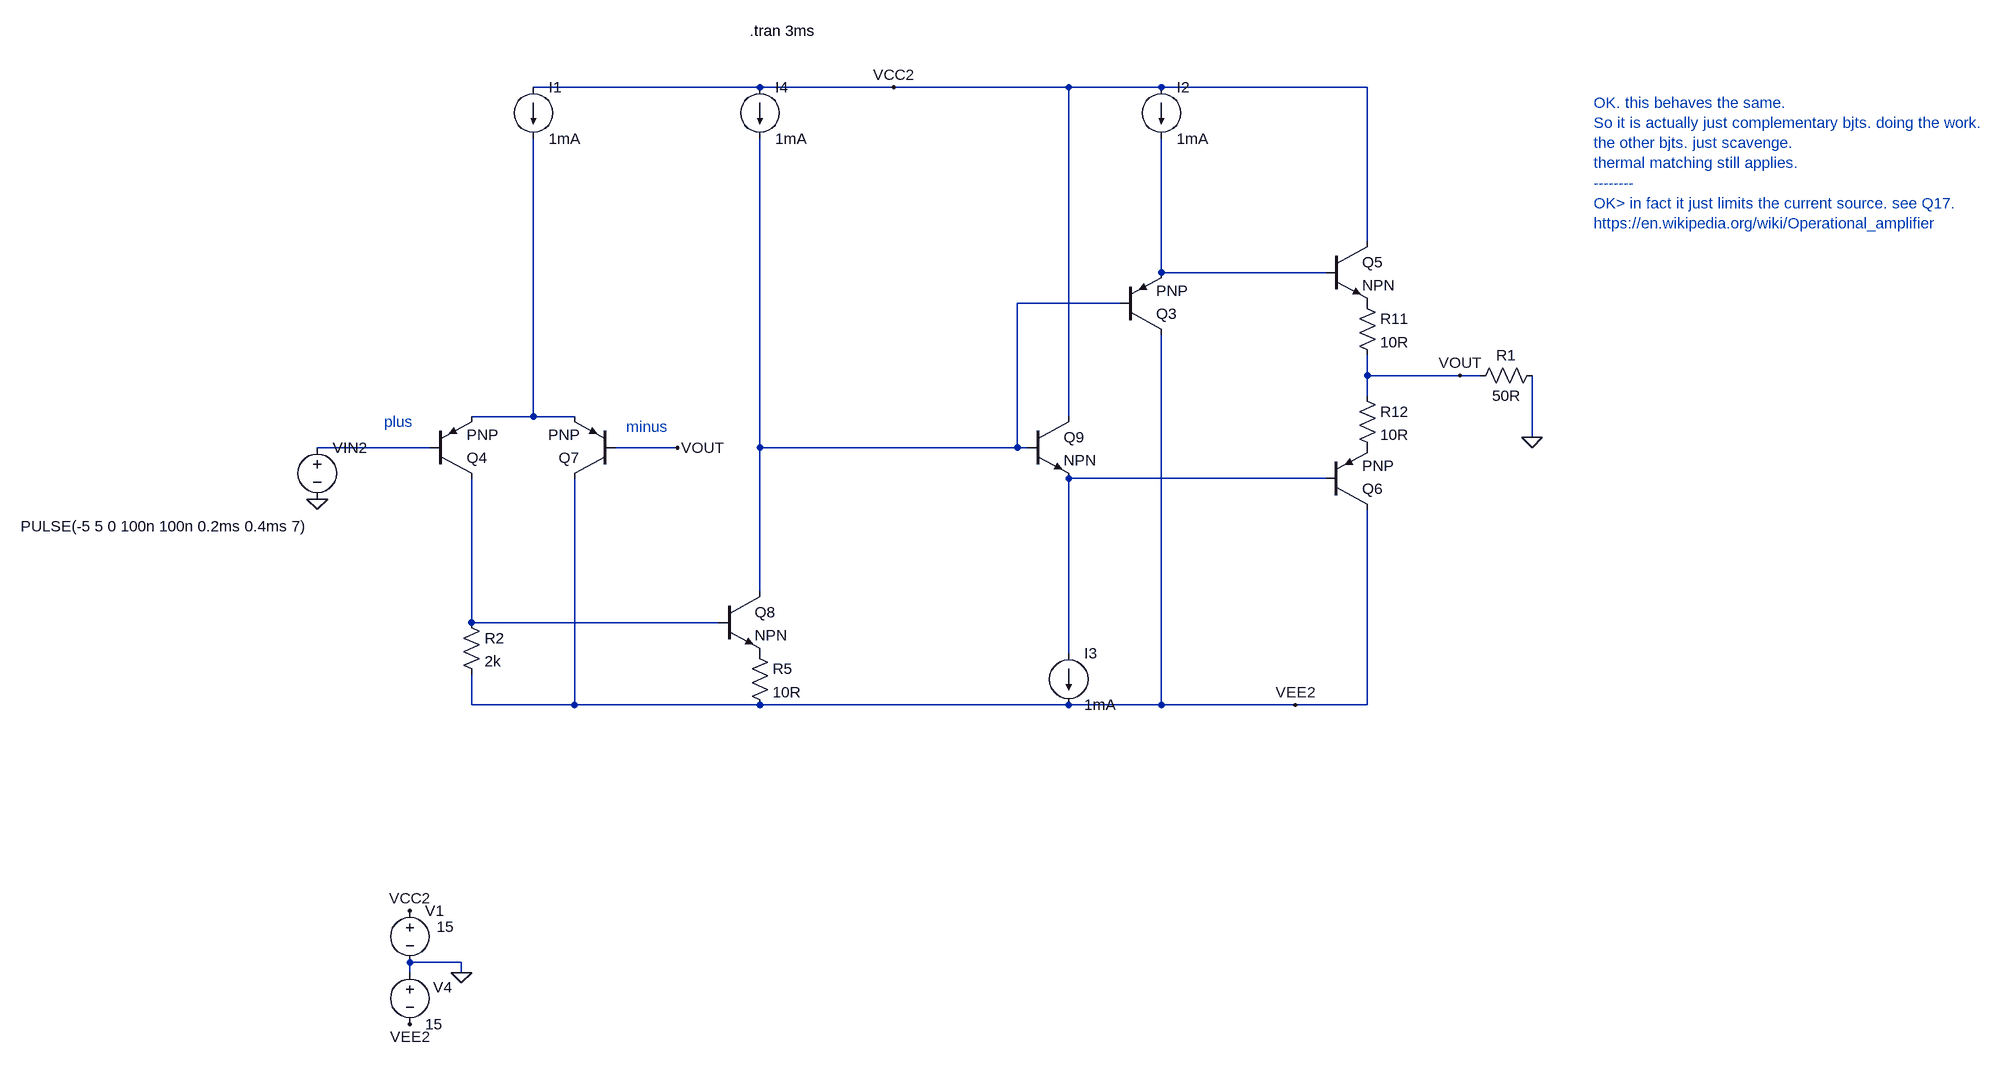
[diagram p0: schematic Draft47.asc]
Draft47.asc, the LTspice schematic file:
Version 4
SHEET 1 2320 1368
WIRE 176 -192 -176 -192
WIRE 384 -192 176 -192
WIRE 656 -192 384 -192
WIRE 800 -192 656 -192
WIRE 1120 -192 800 -192
WIRE 1120 48 1120 -192
WIRE 800 96 800 -112
WIRE 1056 96 800 96
WIRE 736 144 576 144
WIRE 1120 256 1120 224
WIRE 1264 256 1120 256
WIRE 1296 256 1264 256
WIRE 1120 288 1120 256
WIRE -176 320 -176 -112
WIRE -176 320 -272 320
WIRE -112 320 -176 320
WIRE 656 320 656 -192
WIRE 1376 352 1376 256
WIRE -336 368 -512 368
WIRE 48 368 -48 368
WIRE 176 368 176 -112
WIRE 576 368 576 144
WIRE 576 368 176 368
WIRE 592 368 576 368
WIRE 1056 416 656 416
WIRE 176 592 176 368
WIRE -272 640 -272 416
WIRE 112 640 -272 640
WIRE 656 688 656 416
WIRE -272 768 -272 720
WIRE -112 768 -112 416
WIRE -112 768 -272 768
WIRE 176 768 -112 768
WIRE 656 768 176 768
WIRE 800 768 800 192
WIRE 800 768 656 768
WIRE 1008 768 800 768
WIRE 1120 768 1120 464
WIRE 1120 768 1008 768
WIRE -288 1168 -368 1168
WIRE -368 1184 -368 1168
WIRE -288 1184 -288 1168
FLAG -288 1184 0
FLAG -368 1088 VCC2
FLAG -368 1264 VEE2
FLAG 384 -192 VCC2
FLAG 1008 768 VEE2
FLAG 1264 256 VOUT
FLAG 1376 352 0
FLAG -512 448 0
FLAG 48 368 VOUT
SYMBOL voltage -368 1072 R0
WINDOW 123 0 0 Left 0
WINDOW 39 0 0 Left 0
WINDOW 3 42 41 Left 2
SYMATTR Value 15
SYMATTR InstName V1
SYMBOL voltage -368 1168 R0
WINDOW 123 0 0 Left 0
WINDOW 39 0 0 Left 0
WINDOW 0 36 39 Left 2
SYMATTR InstName V4
SYMATTR Value 15
SYMBOL npn 1056 48 R0
SYMATTR InstName Q5
SYMBOL res 1104 128 R0
SYMATTR InstName R11
SYMATTR Value 10R
SYMBOL res 1104 272 R0
SYMATTR InstName R12
SYMATTR Value 10R
SYMBOL pnp 1056 464 M180
SYMATTR InstName Q6
SYMBOL current 800 -192 R0
WINDOW 123 0 0 Left 0
WINDOW 39 0 0 Left 0
SYMATTR InstName I2
SYMATTR Value 1mA
SYMBOL pnp 736 192 M180
SYMATTR InstName Q3
SYMBOL npn 592 320 R0
SYMATTR InstName Q9
SYMBOL current 656 688 R0
WINDOW 123 0 0 Left 0
WINDOW 39 0 0 Left 0
SYMATTR InstName I3
SYMATTR Value 1mA
SYMBOL res 1392 240 R90
WINDOW 0 0 56 VBottom 2
WINDOW 3 32 56 VTop 2
SYMATTR InstName R1
SYMATTR Value 50R
SYMBOL voltage -512 352 R0
WINDOW 123 0 0 Left 0
WINDOW 39 0 0 Left 0
WINDOW 3 -461 138 Left 2
SYMATTR Value PULSE(-5 5 0 100n 100n 0.2ms 0.4ms 7)
SYMATTR InstName VIN2
SYMBOL res -288 624 R0
SYMATTR InstName R2
SYMATTR Value 2k
SYMBOL res 160 672 R0
SYMATTR InstName R5
SYMATTR Value 10R
SYMBOL pnp -336 416 M180
SYMATTR InstName Q4
SYMBOL pnp -48 416 R180
SYMATTR InstName Q7
SYMBOL npn 112 592 R0
SYMATTR InstName Q8
SYMBOL current -176 -192 R0
WINDOW 123 0 0 Left 0
WINDOW 39 0 0 Left 0
SYMATTR InstName I1
SYMATTR Value 1mA
SYMBOL current 176 -192 R0
WINDOW 123 0 0 Left 0
WINDOW 39 0 0 Left 0
SYMATTR InstName I4
SYMATTR Value 1mA
TEXT 160 -280 Left 2 !.tran 3ms
TEXT 1472 -168 Left 2 ;OK. this behaves the same.\nSo it is actually just complementary bjts. doing the work.\nthe other bjts. just scavenge.\nthermal matching still applies.\n--------\nOK> in fact it just limits the current source. see Q17.\nhttps://en.wikipedia.org/wiki/Operational_amplifier
TEXT -32 336 Left 2 ;minus
TEXT -408 328 Left 2 ;plus

The netlist it stands for:
* Draft47.asc
V1 VCC2 0 15
V4 0 VEE2 15
Q5 VCC2 N001 P001 0 NPN
R11 P001 VOUT 10R
R12 VOUT P002 10R
Q6 VEE2 N005 P002 0 PNP
I2 VCC2 N001 1mA
Q3 VEE2 N002 N001 0 PNP
Q9 VCC2 N002 N005 0 NPN
I3 N005 VEE2 1mA
R1 0 VOUT 50R
VIN2 N004 0 PULSE(-5 5 0 100n 100n 0.2ms 0.4ms 7)
R2 N006 VEE2 2k
R5 P003 VEE2 10R
Q4 N006 N004 N003 0 PNP
Q7 VEE2 VOUT N003 0 PNP
Q8 N002 N006 P003 0 NPN
I1 VCC2 N003 1mA
I4 VCC2 N002 1mA
.model NPN NPN
.model PNP PNP
.lib standard.bjt
.tran 3ms
* OK. this behaves the same.
* So it is actually just complementary bjts. doing the work.
* the other bjts. just scavenge.
* thermal matching still applies.
* --------
* OK> in fact it just limits the current source. see Q17.
* https://en.wikipedia.org/wiki/Operational_amplifier
* minus
* plus
.backanno
.end